# Altium schematic sheet [03] GSM_GPRS.SchDoc: GSM_GPRS
size A4
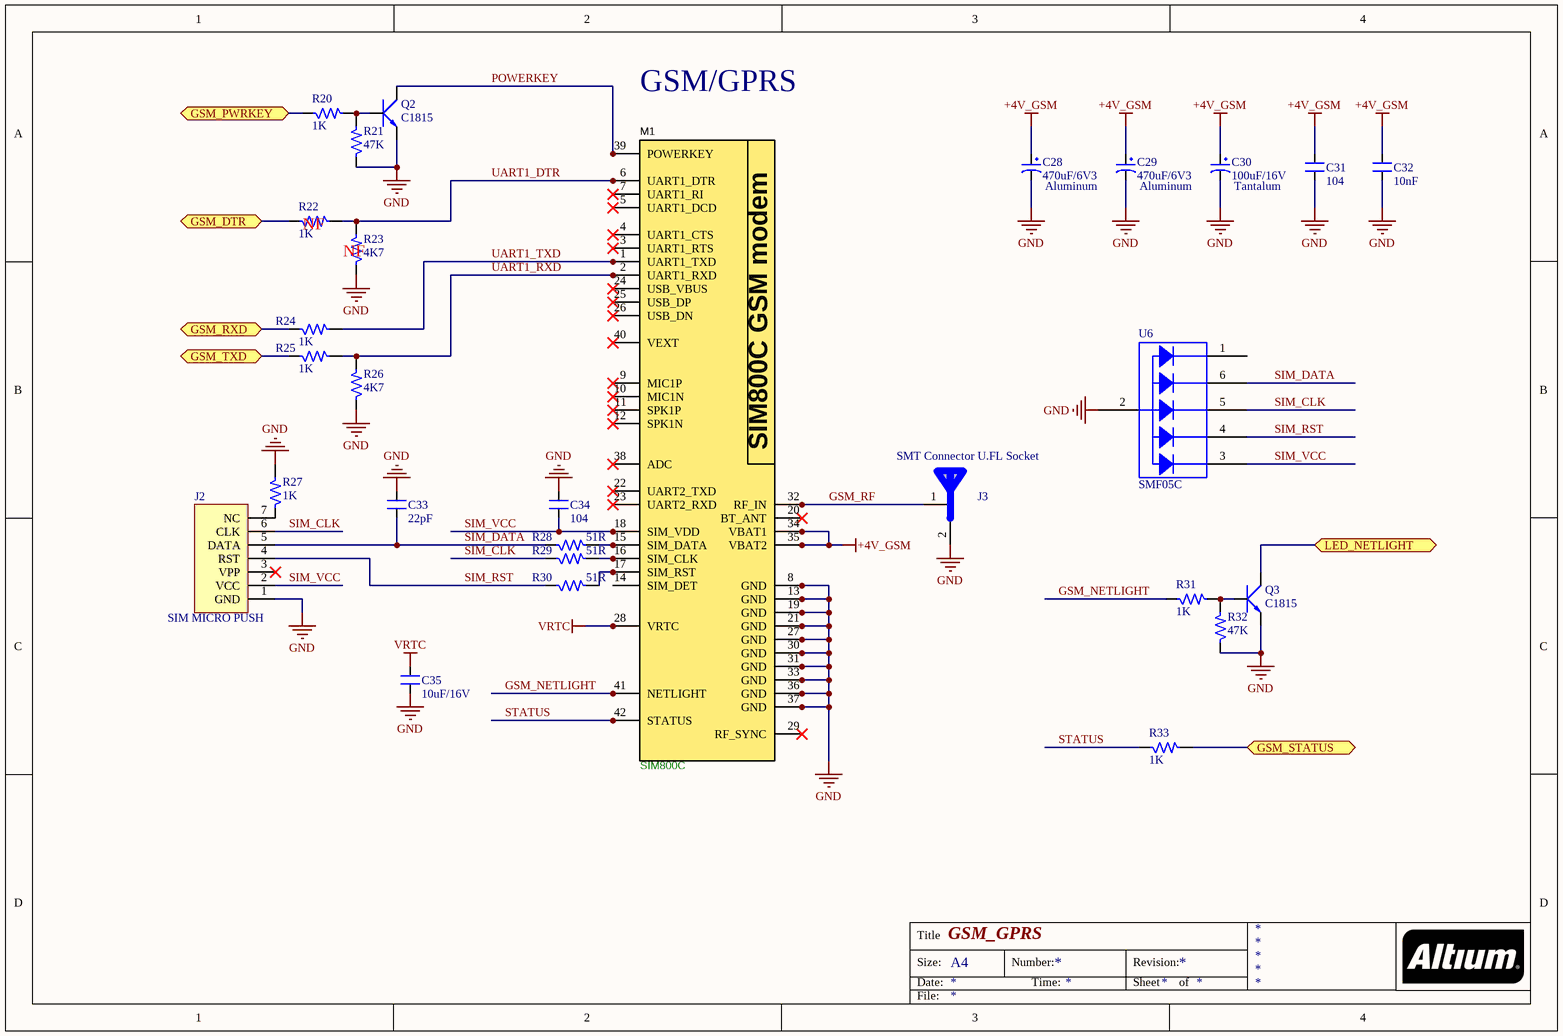
[diagram p0: [03] GSM_GPRS.SchDoc]

## Parts
C28  470uF/6V3  [C_Alu_6.3x7.7]
C29  470uF/6V3  [C_Alu_6.3x7.7]
C30  100uF/16V  [C_7343_40]
C31  104  [C0603 SMT]
C32  10nF  [C0603 SMT]
C33  22pF  [C0603 SMT]
C34  104  [C0603 SMT]
C35  10uF/16V  [C0603 SMT]
J2  SIM MICRO PUSH  [MicroSim 6P]
J3  SMT Connector U.FL Socket  [Antenna-IPEX]
M1  SIM800C  [SIM800C]
Q2  C1815  [SOT23B]
Q3  C1815  [SOT23B]
R20  1K  [R0603 -SMT]
R21  47K  [R0603 -SMT]
R22  1K  [R0603 -SMT]
R23  4K7  [R0603 -SMT]
R24  1K  [R0603 -SMT]
R25  1K  [R0603 -SMT]
R26  4K7  [R0603 -SMT]
R27  1K  [R0805 SMT]
R28  51R  [R0603 -SMT]
R29  51R  [R0603 -SMT]
R30  51R  [R0603 -SMT]
R31  1K  [R0603 -SMT]
R32  47K  [R0603 -SMT]
R33  1K  [R0603 -SMT]
U6  SMF05C  [SOT_363_6]

## Ports
GSM_DTR, GSM_PWRKEY, GSM_RXD, GSM_STATUS, GSM_TXD, LED_NETLIGHT

## Nets
+4V_GSM: C28.1 C29.1 C30.1 C31.1 C32.1 M1.34(VBAT1) M1.35(VBAT2)
GND: C28.2 C29.2 C30.2 C31.2 C32.2 C33.2 C34.2 C35.2 J2.1(GND) J3.2(GND) M1.8(GND) M1.13(GND) M1.19(GND) M1.21(GND) M1.27(GND) M1.30(GND) M1.31(GND) M1.33(GND) M1.36(GND) M1.37(GND) Q2.1(E) Q3.1(E) R21.1 R23.1 R26.1 R27.2 R32.1 U6.2(A)
VRTC: C35.1 M1.28(VRTC)
GSM_DTR: R22.1 ; port GSM_DTR
GSM_NETLIGHT: M1.41(NETLIGHT) R31.1
GSM_PWRKEY: R20.1 ; port GSM_PWRKEY
GSM_RF: J3.1(GND) M1.32(RF_IN)
GSM_RXD: R24.1 ; port GSM_RXD
GSM_STATUS: R33.2 ; port GSM_STATUS
GSM_TXD: R25.1 ; port GSM_TXD
LED_NETLIGHT: Q3.2(C) ; port LED_NETLIGHT
POWERKEY: M1.39(POWERKEY) Q2.2(C)
SIM_CLK: J2.6(CLK) R29.1 U6.5(K4)
SIM_DATA: C33.1 J2.5(DATA) R28.1 U6.6(K5)
SIM_RST: J2.4(RST) R30.1 U6.4(K3)
SIM_VCC: C34.1 J2.2(VCC) M1.18(SIM_VDD) U6.3(K2)
STATUS: M1.42(STATUS) R33.1
UART1_DTR: M1.6(UART1_DTR) R22.2 R23.2
UART1_RXD: M1.2(UART1_RXD) R25.2 R26.2
UART1_TXD: M1.1(UART1_TXD) R24.2
NetJ2_7: J2.7(NC) R27.1
NetM1_15: M1.15(SIM_DATA) R28.2
NetM1_16: M1.16(SIM_CLK) R29.2
NetM1_17: M1.17(SIM_RST) R30.2
NetQ2_3: Q2.3(B) R20.2 R21.2
NetQ3_3: Q3.3(B) R31.2 R32.2

Not connected (* = marked no-connect by the designer): J2 3(VPP)*; M1 3(UART1_RTS)* 4(UART1_CTS)* 5(UART1_DCD)* 7(UART1_RI)* 9(MIC1P)* 10(MIC1N)* 11(SPK1P)* 12(SPK1N)* 14(SIM_DET) 20(BT_ANT)* 22(UART2_TXD)* 23(UART2_RXD)* 24(USB_VBUS)* 25(USB_DP)* 26(USB_DN)* 29(RF_SYNC)* 38(ADC)* 40(VEXT)*; U6 1(K1)

## Notes on the sheet
- GSM/GPRS
- (near R22) NF
- (near C28) Aluminum
- (near C29) Aluminum
- (near C30) Tantalum
- (near R23) NF
- Title
- Size:
- Date:
- A4
- Number:
- Time:
- Revision:
- Sheet
- of
- File:
- (in symbol SIM800C) SIM800C GSM modem

## Library data of the parts
C28 C29 = C-Alu-Tantalum: Cap Aluminum; Value: 10uF/50V; Description 1: 10 => 220uF/6,3V/10V - 10uF => 100uF/16V; Description 2: 0,1uF => 33uF/50V - 10uF => 22uF/63V; Description 3: 0,47uF => 10uF/100V
C30 = C-Alu-Tantalum: Cap Tantalum 7343; Value: 10uF/50V; Description 1: 10 => 220uF/6,3V/10V - 10uF => 100uF/16V; Description 2: 0,1uF => 33uF/50V - 10uF => 22uF/63V; Description 3: 0,47uF => 10uF/100V
C31-C35 = CM: Cap SMD; Value: 103
J3 = ANTEN
Q2 Q3 = C1815: NPN 600mW, ECB; Value: C1815
R20 R22 R24 R25 R27 R31 R33 = RM: Resistor SMD; Value: 1K
R21 R23 R26 R28-R30 R32 = RM: Resistor SMD; Value: 1K
U6 = SMF05C: ESD Protection